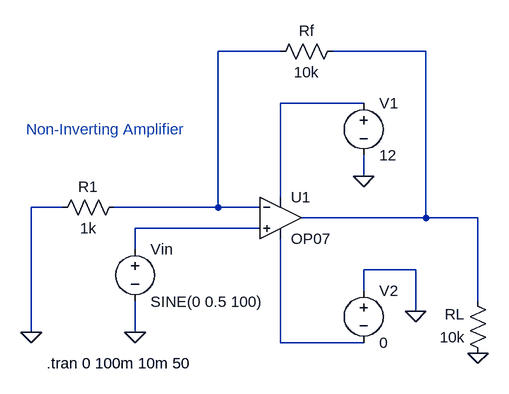
[diagram p0: schematic Non-Inverting.asc]
Non-Inverting.asc, the LTspice schematic file:
Version 4
SHEET 1 880 680
WIRE 144 -96 48 -96
WIRE 368 -96 224 -96
WIRE 272 -16 144 -16
WIRE 272 96 272 64
WIRE 144 128 144 -16
WIRE -192 144 -240 144
WIRE 48 144 48 -96
WIRE 48 144 -112 144
WIRE 112 144 48 144
WIRE 368 160 368 -96
WIRE 368 160 176 160
WIRE 448 160 368 160
WIRE 112 176 -80 176
WIRE -80 208 -80 176
WIRE 352 240 272 240
WIRE 272 272 272 240
WIRE 448 288 448 160
WIRE 352 304 352 240
WIRE -240 336 -240 144
WIRE -80 336 -80 288
WIRE 144 352 144 192
WIRE 272 352 144 352
FLAG 272 96 0
FLAG 352 304 0
FLAG -80 336 0
FLAG -240 336 0
FLAG 448 368 0
SYMBOL res -96 128 R90
WINDOW 0 0 56 VBottom 2
WINDOW 3 32 56 VTop 2
SYMATTR InstName R1
SYMATTR Value 1k
SYMBOL res 240 -112 R90
WINDOW 0 0 56 VBottom 2
WINDOW 3 32 56 VTop 2
SYMATTR InstName Rf
SYMATTR Value 10k
SYMBOL res 464 384 R180
WINDOW 0 36 76 Left 2
WINDOW 3 36 40 Left 2
SYMATTR InstName RL
SYMATTR Value 10k
SYMBOL voltage -80 192 R0
WINDOW 3 24 97 Left 2
SYMATTR Value SINE(0 0.5 100)
SYMATTR InstName Vin
SYMBOL voltage 272 -32 R0
SYMATTR InstName V1
SYMATTR Value 12
SYMBOL voltage 272 256 R0
SYMATTR InstName V2
SYMATTR Value 0
SYMBOL OpAmps\\OP07 144 96 R0
SYMATTR InstName U1
TEXT -216 384 Left 2 !.tran 0 100m 10m 50
TEXT -248 24 Left 2 ;Non-Inverting Amplifier

The netlist it stands for:
* Non-Inverting.asc
R1 N001 0 1k
Rf N002 N001 10k
RL 0 N002 10k
Vin N004 0 SINE(0 0.5 100)
V1 N003 0 12
V2 0 N005 0
XU1 N004 N001 N003 N005 N002 LT1001  ; OP07, pins In+ In- V+ V- OUT
.tran 0 100m 10m 50
* Non-Inverting Amplifier
.lib LTC.lib
.backanno
.end